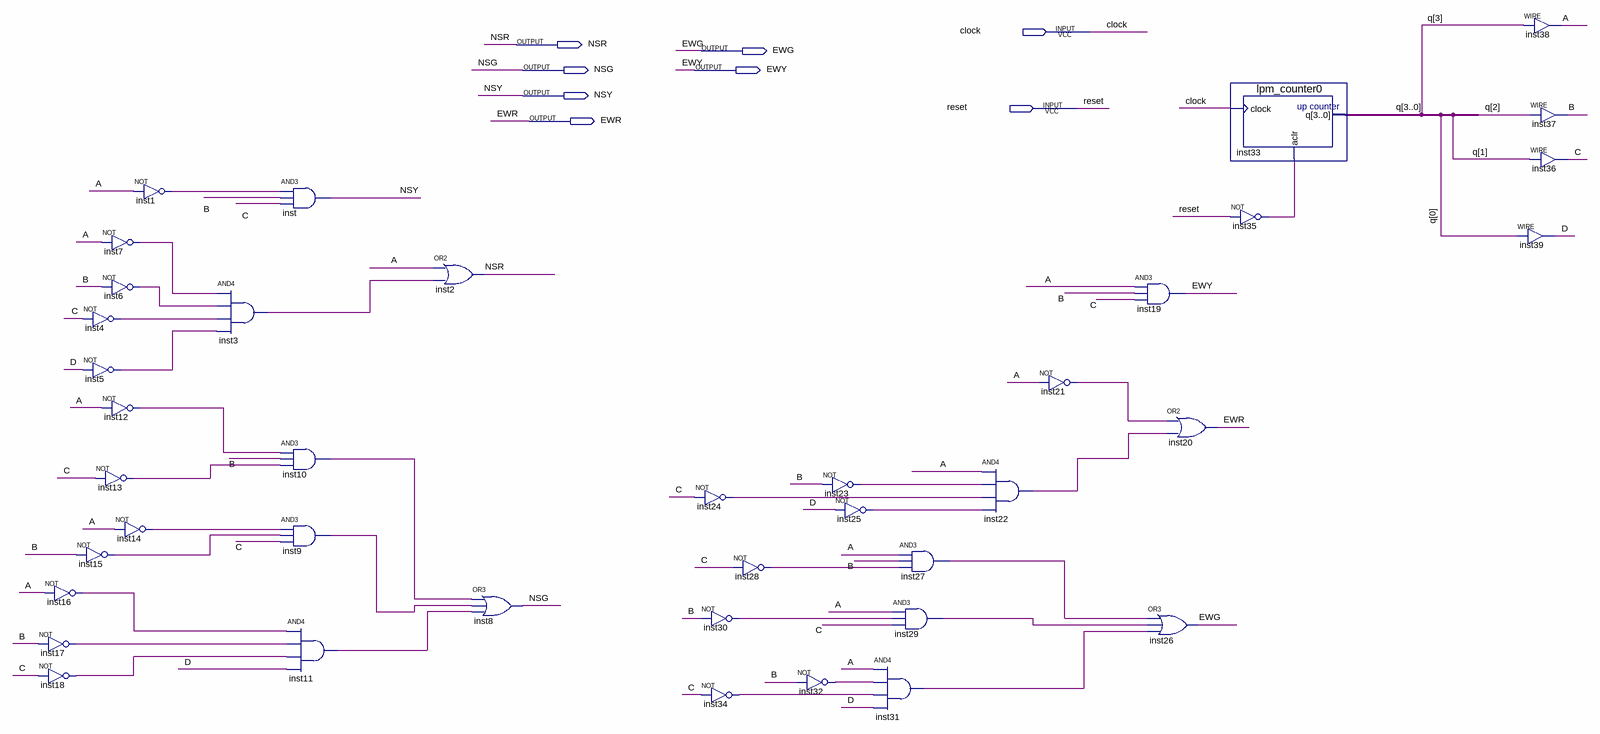
[diagram p0: schematic sheet]
// Quartus schematic Traffic.bdf as structural Verilog: 40 symbols, 8 pins
module Traffic (
  input  clock,
  input  reset,
  output NSR,
  output EWG,
  output NSG,
  output EWY,
  output NSY,
  output EWR
);

  wire A, B, C, D, inst1_out, inst3_out, inst4_out, inst5_out, inst6_out, inst7_out, inst9_out, inst10_out,
       inst11_out, inst12_out, inst13_out, inst14_out, inst15_out, inst16_out, inst17_out, inst18_out,
       inst21_out, inst22_out, inst23_out, inst24_out, inst25_out, inst27_out, inst28_out, inst29_out,
       inst30_out, inst31_out, inst32_out, inst34_out, inst35_out;
  wire [3:0] q;

  not inst16 (inst16_out, A);
  not inst17 (inst17_out, B);
  not inst18 (inst18_out, C);
  not inst7 (inst7_out, A);
  not inst6 (inst6_out, B);
  not inst4 (inst4_out, C);
  not inst5 (inst5_out, D);
  not inst12 (inst12_out, A);
  not inst13 (inst13_out, C);
  not inst15 (inst15_out, B);
  not inst1 (inst1_out, A);
  not inst14 (inst14_out, A);
  and inst3 (inst3_out, inst7_out, inst6_out, inst4_out, inst5_out);
  and inst (NSY, inst1_out, B, C);
  and inst10 (inst10_out, inst12_out, B, inst13_out);
  and inst9 (inst9_out, inst14_out, inst15_out, C);
  and inst11 (inst11_out, inst16_out, inst17_out, inst18_out, D);
  or inst2 (NSR, A, inst3_out);
  or inst8 (NSG, inst10_out, inst9_out, inst11_out);
  not inst24 (inst24_out, C);
  not inst30 (inst30_out, B);
  not inst34 (inst34_out, C);
  not inst28 (inst28_out, C);
  not inst32 (inst32_out, B);
  not inst23 (inst23_out, B);
  not inst25 (inst25_out, D);
  and inst27 (inst27_out, A, B, inst28_out);
  and inst29 (inst29_out, A, inst30_out, C);
  and inst31 (inst31_out, A, inst32_out, inst34_out, D);
  and inst22 (inst22_out, A, inst23_out, inst24_out, inst25_out);
  not inst21 (inst21_out, A);
  and inst19 (EWY, A, B, C);
  or inst20 (EWR, inst21_out, inst22_out);
  or inst26 (EWG, inst27_out, inst29_out, inst31_out);
  lpm_counter0 inst33 (.clock(clock), .aclr(inst35_out), .q(q));
  not inst35 (inst35_out, reset);
  assign A = q[3];  // WIRE inst38
  assign B = q[2];  // WIRE inst37
  assign C = q[1];  // WIRE inst36
  assign D = q[0];  // WIRE inst39
endmodule
